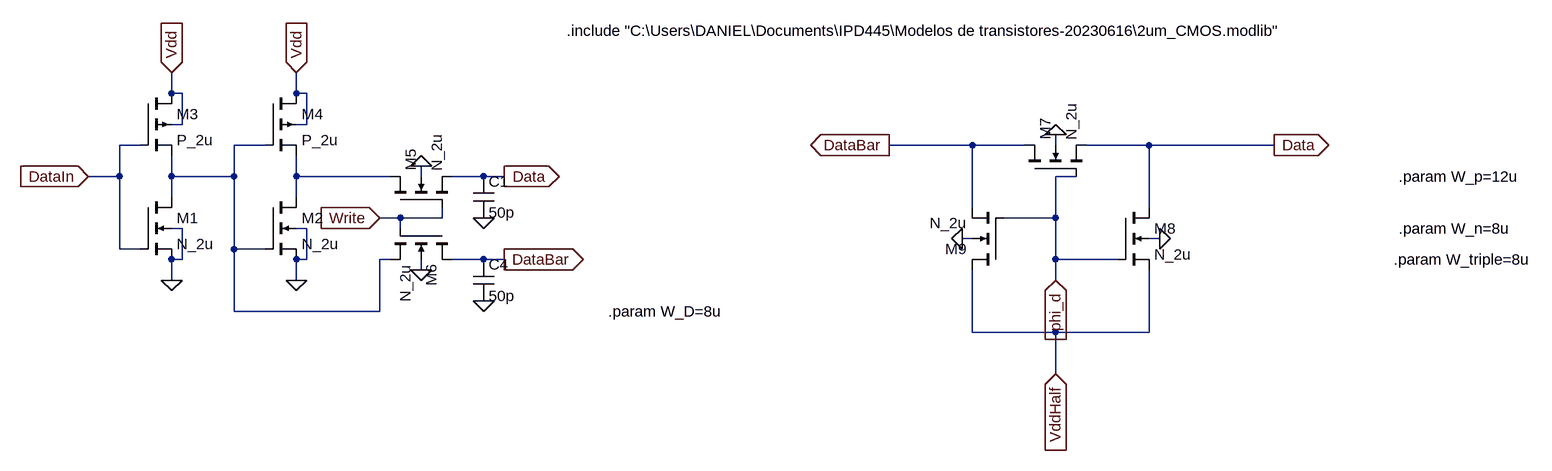
[diagram p0: schematic Drivers.asc]
Drivers.asc, the LTspice schematic file:
Version 4
SHEET 1 2652 1000
WIRE 48 16 48 -16
WIRE 64 16 48 16
WIRE 240 16 240 -16
WIRE 256 16 240 16
WIRE 64 64 64 16
WIRE 64 64 48 64
WIRE 256 64 256 16
WIRE 256 64 240 64
WIRE 0 96 -32 96
WIRE 192 96 144 96
WIRE 1280 96 1152 96
WIRE 1360 96 1280 96
WIRE 1408 96 1408 80
WIRE 1552 96 1456 96
WIRE 1744 96 1552 96
WIRE -32 144 -32 96
WIRE -32 144 -80 144
WIRE 48 144 48 112
WIRE 144 144 144 96
WIRE 144 144 48 144
WIRE 240 144 240 112
WIRE 384 144 240 144
WIRE 432 144 432 128
WIRE 528 144 480 144
WIRE 560 144 528 144
WIRE 1440 144 1408 144
WIRE 48 176 48 144
WIRE 240 176 240 144
WIRE 1280 192 1280 96
WIRE 1552 192 1552 96
WIRE 400 208 368 208
WIRE 464 208 464 192
WIRE 464 208 400 208
WIRE 1408 208 1408 144
WIRE 1408 208 1328 208
WIRE 64 224 48 224
WIRE 256 224 240 224
WIRE 400 224 400 208
WIRE 1280 240 1264 240
WIRE 1568 240 1552 240
WIRE -32 256 -32 144
WIRE 0 256 -32 256
WIRE 144 256 144 144
WIRE 192 256 144 256
WIRE 64 272 64 224
WIRE 64 272 48 272
WIRE 256 272 256 224
WIRE 256 272 240 272
WIRE 384 272 368 272
WIRE 528 272 480 272
WIRE 560 272 528 272
WIRE 1408 272 1408 208
WIRE 1504 272 1408 272
WIRE 432 288 432 272
WIRE 48 304 48 272
WIRE 240 304 240 272
WIRE 1408 304 1408 272
WIRE 144 352 144 256
WIRE 368 352 368 272
WIRE 368 352 144 352
WIRE 1280 384 1280 288
WIRE 1408 384 1280 384
WIRE 1552 384 1552 288
WIRE 1552 384 1408 384
WIRE 1408 448 1408 384
FLAG 48 304 0
FLAG 240 304 0
FLAG 48 -16 Vdd
IOPIN 48 -16 In
FLAG 240 -16 Vdd
IOPIN 240 -16 In
FLAG -80 144 DataIn
IOPIN -80 144 In
FLAG 1408 448 VddHalf
IOPIN 1408 448 In
FLAG 1408 304 phi_d
IOPIN 1408 304 In
FLAG 368 208 Write
IOPIN 368 208 In
FLAG 560 144 Data
IOPIN 560 144 Out
FLAG 560 272 DataBar
IOPIN 560 272 Out
FLAG 1152 96 DataBar
IOPIN 1152 96 Out
FLAG 1744 96 Data
IOPIN 1744 96 Out
FLAG 528 208 0
FLAG 528 336 0
FLAG 432 288 0
FLAG 432 128 0
FLAG 1264 240 0
FLAG 1408 80 0
FLAG 1568 240 0
SYMBOL nmos4 0 176 R0
SYMATTR InstName M1
SYMATTR Value N_2u
SYMATTR Value2 l=2u w={W_n}
SYMBOL nmos4 192 176 R0
SYMATTR InstName M2
SYMATTR Value N_2u
SYMATTR Value2 l=2u w={W_n}
SYMBOL pmos4 0 16 R0
SYMATTR InstName M3
SYMATTR Value P_2u
SYMATTR Value2 l=2u w={W_p}
SYMBOL pmos4 192 16 R0
SYMATTR InstName M4
SYMATTR Value P_2u
SYMATTR Value2 l=2u w={W_p}
SYMBOL nmos4 384 192 R270
SYMATTR InstName M5
SYMATTR Value N_2u
SYMATTR Value2 l=2u w={W_D}
SYMBOL nmos4 1360 144 R270
SYMATTR InstName M7
SYMATTR Value N_2u
SYMATTR Value2 l=2u w={W_triple}
SYMBOL nmos4 1504 192 R0
SYMATTR InstName M8
SYMATTR Value N_2u
SYMATTR Value2 l=2u w={W_triple}
SYMBOL nmos4 1328 288 R180
SYMATTR InstName M9
SYMATTR Value N_2u
SYMATTR Value2 l=2u w={W_triple}
SYMBOL nmos4 480 224 R90
SYMATTR InstName M6
SYMATTR Value N_2u
SYMATTR Value2 l=2u w={W_D}
SYMBOL cap 512 144 R0
SYMATTR InstName C1
SYMATTR Value 50p
SYMBOL cap 512 272 R0
SYMATTR InstName C4
SYMATTR Value 50p
TEXT 656 -80 Left 2 !.include "C:\\Users\\DANIEL\\Documents\\IPD445\\Modelos de transistores-20230616\\2um_CMOS.modlib"
TEXT 1936 144 Left 2 !.param W_p=12u
TEXT 1936 224 Left 2 !.param W_n=8u
TEXT 720 352 Left 2 !.param W_D=8u
TEXT 1928 272 Left 2 !.param W_triple=8u

The netlist it stands for:
* Drivers.asc
M1 N001 DataIn 0 0 N_2u l=2u w={W_n}
M2 N002 N001 0 0 N_2u l=2u w={W_n}
M3 Vdd DataIn N001 Vdd P_2u l=2u w={W_p}
M4 Vdd N001 N002 Vdd P_2u l=2u w={W_p}
M5 N002 Write Data 0 N_2u l=2u w={W_D}
M7 DataBar phi_d Data 0 N_2u l=2u w={W_triple}
M8 Data phi_d VddHalf 0 N_2u l=2u w={W_triple}
M9 VddHalf phi_d DataBar 0 N_2u l=2u w={W_triple}
M6 DataBar Write N001 0 N_2u l=2u w={W_D}
C1 Data 0 50p
C4 DataBar 0 50p
.model NMOS NMOS
.model PMOS PMOS
.lib standard.mos
.include "C:\Users\DANIEL\Documents\IPD445\Modelos de transistores-20230616\2um_CMOS.modlib"
.param W_p=12u
.param W_n=8u
.param W_D=8u
.param W_triple=8u
.backanno
.end